# EasyEDA Pro project PCB.eprj, schematic Schematic1_1
Board Name: tc264_拓展_1; Create Date: 2025-07-30; Page Name: P1; Project Name: RG_PCB; Schematic Name: Schematic1_1; Update Date: 2025-07-30; Company: 嘉立创EDA; Page Size: A3; Version: V1.0
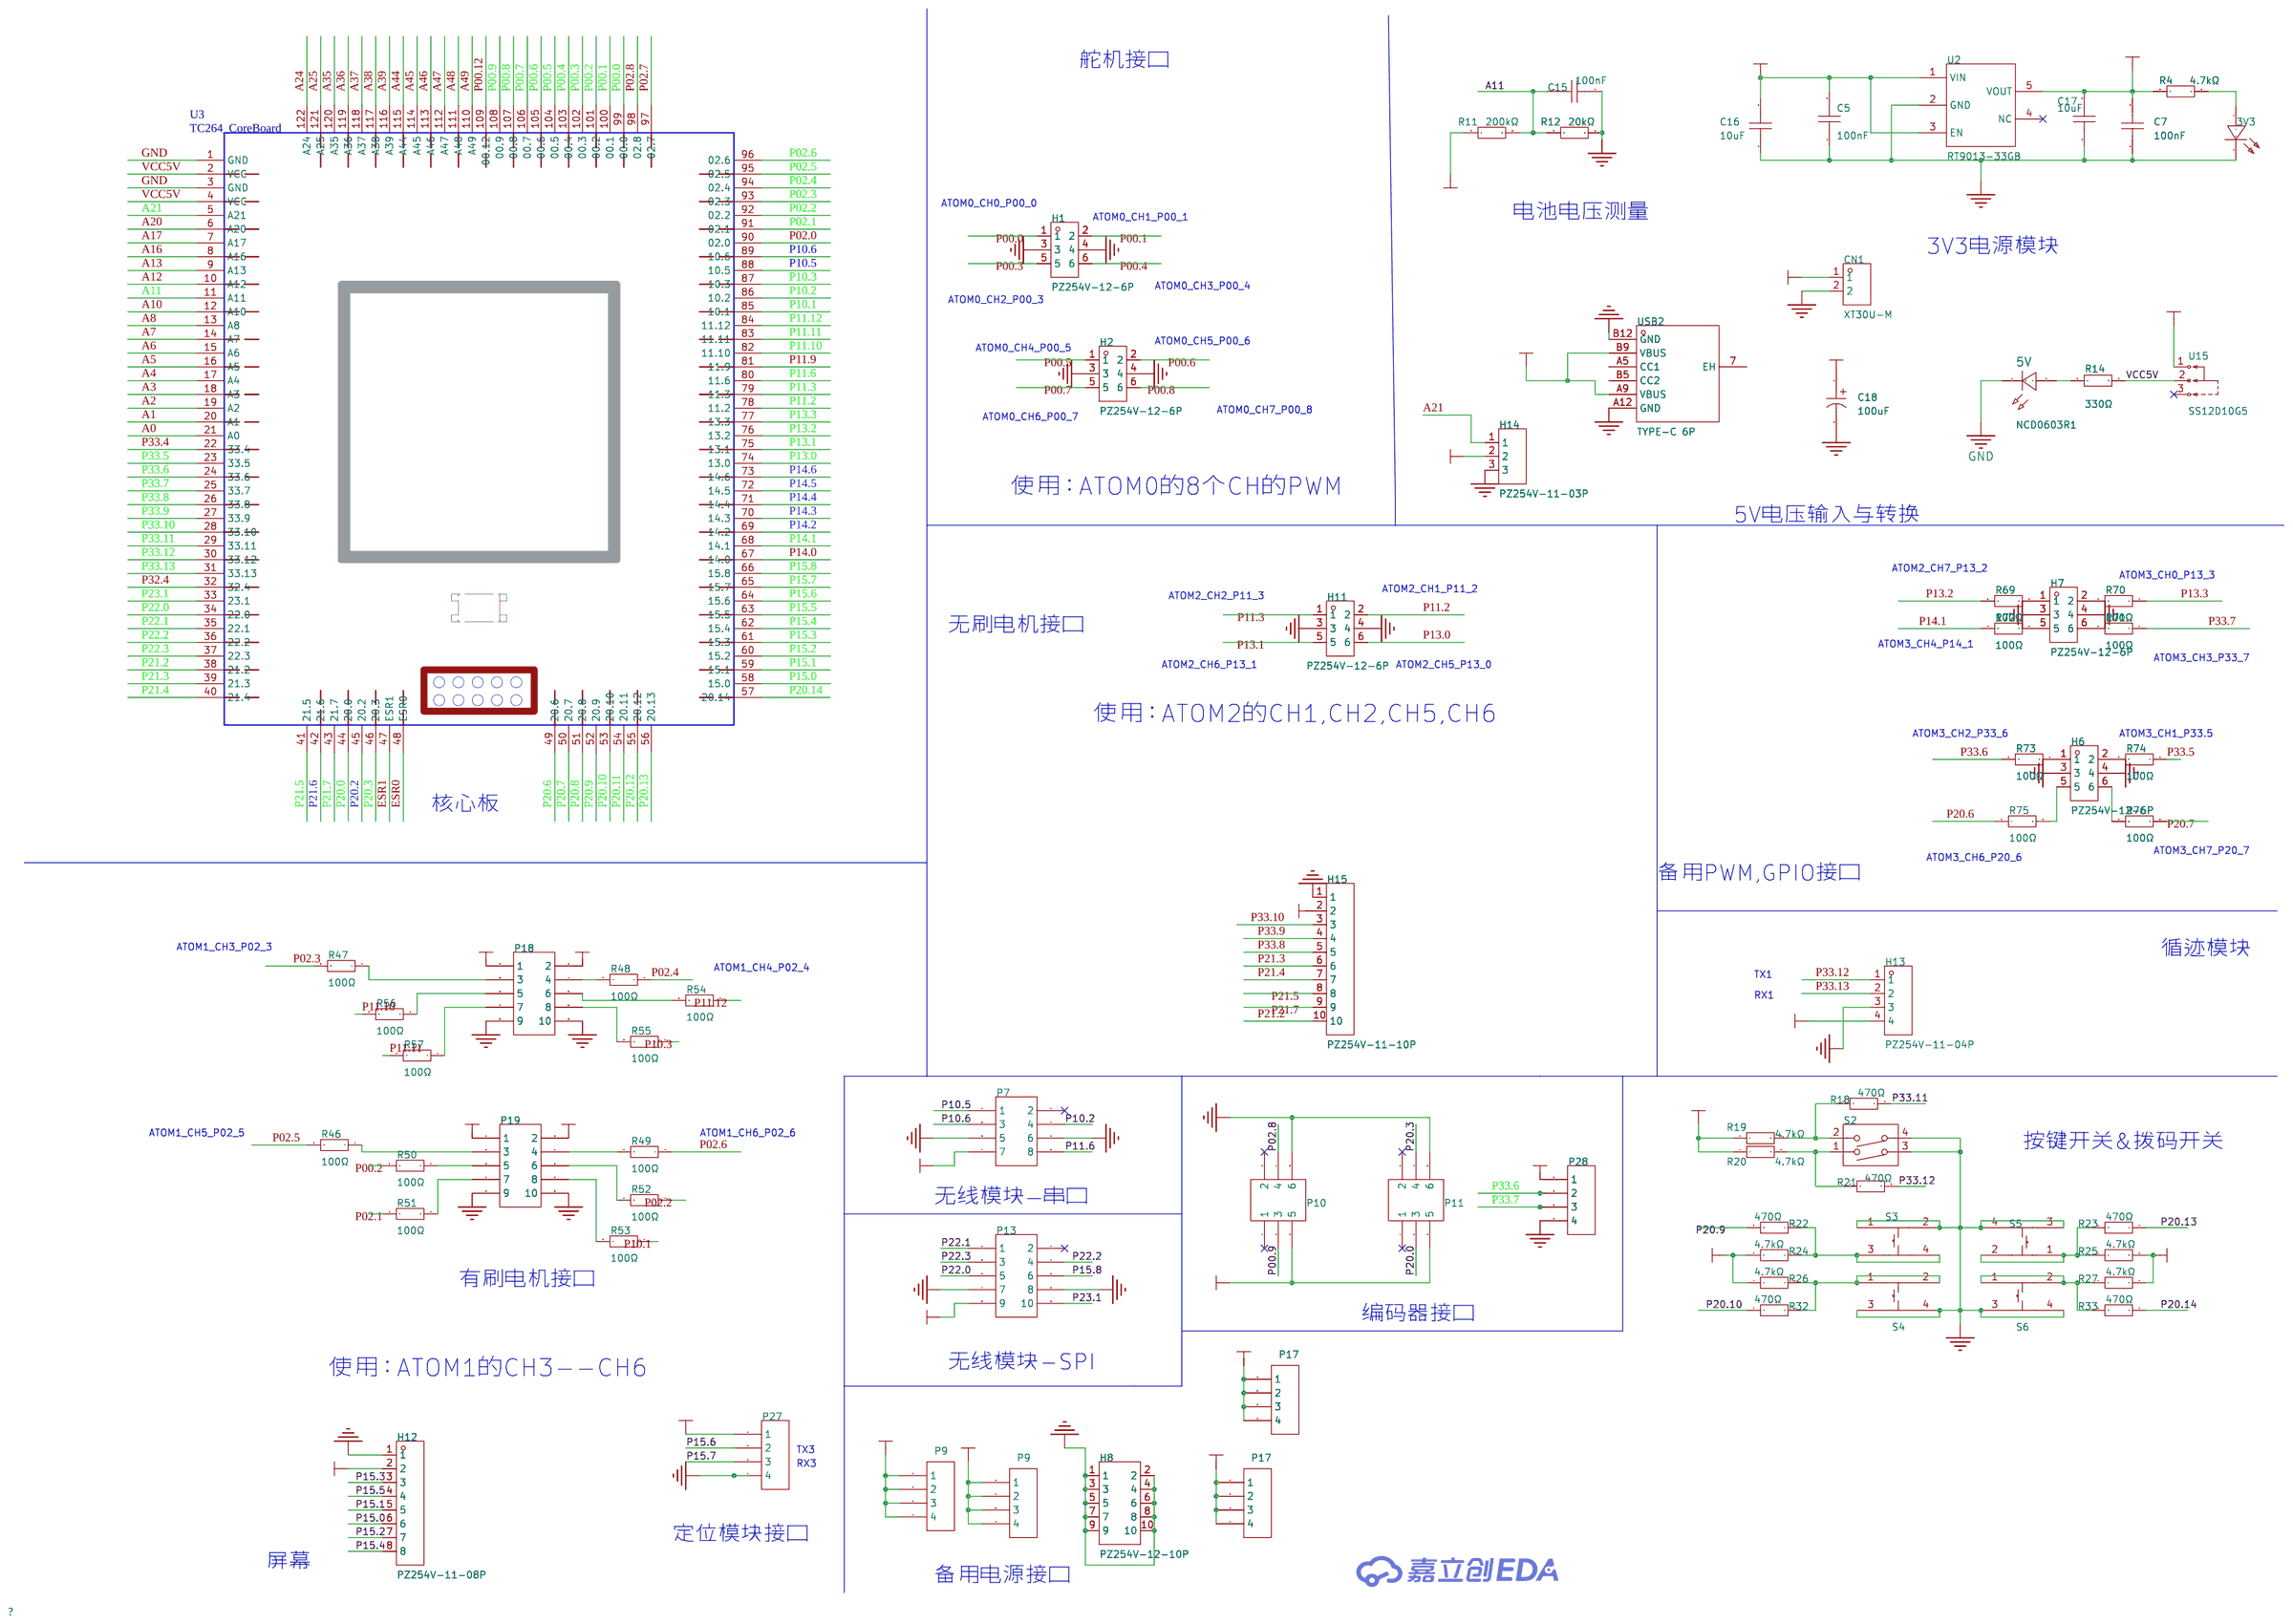
[diagram p1: schematic sheet]

## Parts
3V3  15-21VGC/TR8  [LED0603_GREEN]
5V  NCD0603R1  [LED0603-RD_RED]
C5  100nF  [C0603]
C7  100nF  [C0603]
C15  100nF  [C0603]
C16  10uF  [C1206]
C17  10uF  [C1206]
C18  100uF  [CAP-SMD_BD6.3-L6.6-W6.6-LS7.3-FD]
CN1  XT30U-M  [CONN-TH_XT30U-M]
H1  PZ254V-12-6P  [HDR-TH_6P-P2.54-V-M-R2-C3-S2.54]
H2  PZ254V-12-6P  [HDR-TH_6P-P2.54-V-M-R2-C3-S2.54]
H6  PZ254V-12-6P  [HDR-TH_6P-P2.54-V-M-R2-C3-S2.54]
H7  PZ254V-12-6P  [HDR-TH_6P-P2.54-V-M-R2-C3-S2.54]
H8  PZ254V-12-10P  [HDR-TH_10P-P2.54-V-M-R2-C5-S2.54]
H11  PZ254V-12-6P  [HDR-TH_6P-P2.54-V-M-R2-C3-S2.54]
H12  PZ254V-11-08P  [HDR-TH_8P-P2.54-V-M]
H13  PZ254V-11-04P  [HDR-TH_4P-P2.54-V-M]
H14  PZ254V-11-03P  [HDR-TH_3P-P2.54-V-M]
H15  PZ254V-11-10P  [HDR-TH_10P-P2.54-V-M]
P2  P9  [HDR1X4]
P6  P17  [HDR1X4]
P7  -  [HDR2X4]
P10  -  [HDR2X3]
P11  -  [HDR2X3]
P13  -  [HDR2X5]
P18  -  [HDR2X5]
P19  -  [HDR2X5]
P25  P9  [HDR1X4]
P26  P17  [HDR1X4]
P27  -  [HDR1X4]
P28  -  [HDR1X4]
R4  4.7kΩ  [R0603]
R11  200kΩ  [R0603]
R12  20kΩ  [R0603]
R14  330Ω  [R0603]
R18  470Ω  [R0603]
R19  4.7kΩ  [R0603]
R20  4.7kΩ  [R0603]
R21  470Ω  [R0603]
R22  470Ω  [R0603]
R23  470Ω  [R0603]
R24  4.7kΩ  [R0603]
R25  4.7kΩ  [R0603]
R26  4.7kΩ  [R0603]
R27  4.7kΩ  [R0603]
R32  470Ω  [R0603]
R33  470Ω  [R0603]
R46  100Ω  [R0603]
R47  100Ω  [R0603]
R48  100Ω  [R0603]
R49  100Ω  [R0603]
R50  100Ω  [R0603]
R51  100Ω  [R0603]
R52  100Ω  [R0603]
R53  100Ω  [R0603]
R54  100Ω  [R0603]
R55  100Ω  [R0603]
R56  100Ω  [R0603]
R57  100Ω  [R0603]
R69  100Ω  [R0603]
R70  100Ω  [R0603]
R71  100Ω  [R0603]
R72  100Ω  [R0603]
R73  100Ω  [R0603]
R74  100Ω  [R0603]
R75  100Ω  [R0603]
R76  100Ω  [R0603]
S2  拨码开关,平拨开关,DSWB02LHGET  [SW-TH_DSWB02LHGET]
S3  SKRPACE010  [KEY-SMD_4P-L4.2-W3.2-P2.20-LS4.6]
S4  SKRPACE010  [KEY-SMD_4P-L4.2-W3.2-P2.20-LS4.6]
S5  SKRPACE010  [KEY-SMD_4P-L4.2-W3.2-P2.20-LS4.6]
S6  SKRPACE010  [KEY-SMD_4P-L4.2-W3.2-P2.20-LS4.6]
U2  RT9013-33GB  [SOT-23-5_L3.0-W1.7-P0.95-LS2.8-BL]
U3  TC264_CoreBoard  [TC264_CoreBoard]
U15  SS12D10G5  [SW-TH_SHOU-HAN_SS12D10G4]
USB2  TYPE-C 6P  [TYPE-C-SMD_TYPE-C-6P]

## Library data of the parts
3V3 = 15-21VGC/TR8: 照明颜色:普绿/黄绿;色温 - CCT（K）:-;主波长/色坐标:571nm;; LCSC Part Name: 发光二极管1206普绿/黄绿; Supplier Part: C131289; Manufacturer: EVERLIGHT(亿光); Supplier Footprint: 1206; JLCPCB Part Class: Extended Part; Datasheet: https://atta.szlcsc.com/upload/public/pdf/source/20170918/C131289_1505726897595976297.pdf; Supplier: LCSC; Mounting Type: 表面贴装; Illumination Color: 普绿/黄绿; Luminous Intensity (IF=20mA): 13mcd; Dominant Wavelength / Coordinate rank: 571nm
5V = NCD0603R1_C84263: 灯头类型:-;发光颜色:红色;正向电压(VF):1.6V~2.6V;功率:65mW;正向电流:20mA;主波长:615nm~630nm;二极管配置:独立二极管;透镜颜色:无色透明透镜;色温:-;发光强度:80mcd~220mcd;发光角度:130°;载带方式:-;工作温度:-30℃~+85℃;; Supplier Part: C84263; Manufacturer: 国星光电; Supplier Footprint: 0603; JLCPCB Part Class: Extended Part; Datasheet: https://atta.szlcsc.com/upload/public/pdf/source/20200820/C84263_DABC6A75E58F576973B407FDBA283D60.pdf; Supplier: LCSC; Emitted Color: 红色; Forward Voltage (VF): 1.6V~2.6V; Power Dissipation: 65mW; Forward Current: 20mA; Dominant Wavelength: 615nm~630nm; Diode Configuration: 独立二极管; Lens Color: 无色透明透镜; Luminous Intensity: 80mcd~220mcd; Viewing Angle: 130°; Operating Temperature: -30℃~+85℃
C5 C7 = CL10B104KB8NNNC: 容值:100nF;精度:±10%;额定电压:50V;材质(温度系数):X7R;; LCSC Part Name: 100nF ±10% 50V; Supplier Part: C1591; Manufacturer: SAMSUNG(三星); Supplier Footprint: 0603; JLCPCB Part Class: Extended Part; Datasheet: https://atta.szlcsc.com/upload/public/pdf/source/20160103/1457707680512.pdf; Supplier: LCSC; Tolerance: ±10%; Voltage Rated: 50V; Temperature Coefficient: X7R
C15 = CL10B104KB8VPJC: 容值:100nF;精度:±10%;额定电压:50V;材质(温度系数):-;; LCSC Part Name: 100nF ±10% 50V; Supplier Part: C2803384; Manufacturer: SAMSUNG(三星); Supplier Footprint: 0603; JLCPCB Part Class: Extended Part; Datasheet: https://atta.szlcsc.com/upload/public/pdf/source/20210617/C346226_6C124442B8E004027ECF60B29F82E9A1.pdf; Supplier: LCSC; Tolerance: ±10%; Voltage Rated: 50V
C16 C17 = CGA1206X5R106K500NT: 容值:10uF;精度:±10%;额定电压:50V;温度系数:X5R;; LCSC Part Name: 10uF ±10% 50V; Supplier Part: C6119958; Manufacturer: HRE(芯声); Supplier Footprint: 1206; Supplier: LCSC; Tolerance: ±10%; Voltage Rating: 50V; Temperature Coefficient: X5R
C18 = MA25V100M6x6: 容值:100uF;精度:±20%;额定电压:25V;纹波电流:2.65A@100kHz;等效串联电阻(ESR):30mΩ@100kHz;类型:聚合物;; LCSC Part Name: 100uF ±20% 25V; Supplier Part: C46550465; Manufacturer: 捷而瑞; Supplier Footprint: SMD,D6.3xL6mm; JLCPCB Part Class: 扩展库; Datasheet: https://atta.szlcsc.com/upload/public/pdf/source/20250527/0775B60C79545A62B473432786128FCC.pdf; Supplier: LCSC; Tolerance: ±20%; Voltage Rating: 25V; Ripple Current: 2.65A@100kHz; Equivalent Series Resistance(ESR): 30mΩ@100kHz; Type: 聚合物; Diameter: 6.3mm; Height - Seated (Max): 6mm; Lifetime: 2000hrs@105℃; Operating Temperature: -55℃~+105℃
CN1 = XT30U-M: 类别:-;类型1:-;; LCSC Part Name: AMASS(艾迈斯)轻量版锂电池插头公头 XT30U-M; Supplier Part: C99101; Manufacturer: AMASS(艾迈斯); JLCPCB Part Class: 扩展库; Datasheet: https://atta.szlcsc.com/upload/public/pdf/source/20170606/1496716542582.pdf; Supplier: LCSC; Type: 插头; Colour: 黄色; InterfaceType: 公头
H1 H2 H6 H7 H11 = PZ254V-12-6P: 插针结构:2x3P;间距:2.54mm;行距:2.54mm;圆针/方针:方针;安装类型:直插;排数:双排;总PIN位数:6P;额定电流:-;额定电压:-;配合针长度:6mm;塑高:2.5mm;端接针长度:3mm;触头材质:黄铜;触头镀层:-;工作温度范围:-40℃~+105℃;颜色:黑色;; LCSC Part Name: 间距:2.54mm 2x3P 直插 方针; Supplier Part: C492420; Manufacturer: XFCN(兴飞); Supplier Footprint: 插件,P=2.54mm; JLCPCB Part Class: 扩展库; Datasheet: https://atta.szlcsc.com/upload/public/pdf/source/20200309/C492420_BAECB307B001054C09D200388220EAE6.pdf; Supplier: LCSC; Pin Structure: 2x3P; Pitch: 2.54mm; Row Spacing: 2.54mm; Circluar Pins/Square Pins: 方针; Mounting Type: 直插; Number of Rows: 双排; Number of Pins: 6P; Length of Mating Pin: 6mm; Insulation Height: 2.5mm; Length of End Connection Pin: 3mm; Contact Material: 黄铜; Operating Temperature Range: -40℃~+105℃; Color: 黑色
H8 = PZ254V-12-10P: 插针结构:2x5P;间距:2.54mm;行距:2.54mm;圆针/方针:方针;安装方式:直插;排数:双排;总PIN位数:10P;额定电流:-;额定电压:-;配合针长度:6mm;塑高:2.5mm;端接针长度:3mm;触头材质:黄铜;触头镀层:-;工作温度:-40℃~+105℃;颜色:黑色;; LCSC Part Name: 2x5P 间距:2.54mm 方针 直插; Supplier Part: C492422; Manufacturer: XFCN(兴飞); Supplier Footprint: 插件,P=2.54mm; JLCPCB Part Class: 扩展库; Datasheet: https://atta.szlcsc.com/upload/public/pdf/source/20200309/C492422_5020CEA01BE7051F9EA9DD81AB0A25E3.pdf; Supplier: LCSC; Pin Structure: 2x5P; Pitch: 2.54mm; Row Spacing: 2.54mm; Circluar Pins/Square Pins: 方针; Mounting Type: 直插; Number of Rows: 双排; Number of Pins: 10P; Length of Mating Pin: 6mm; Insulation Height: 2.5mm; Length of End Connection Pin: 3mm; Contact Material: 黄铜; Operating Temperature: -40℃~+105℃; Color: 黑色
H12 = PZ254V-11-08P: 插针结构:1x8P;间距:2.54mm;行距:-;圆针/方针:方针;安装类型:直插;排数:单排;总PIN位数:8P;额定电流:-;额定电压:-;配合针长度:6mm;塑高:2.5mm;端接针长度:3mm;触头材质:黄铜;触头镀层:-;工作温度范围:-40℃~+105℃;颜色:黑色;; LCSC Part Name: 间距:2.54mm 1x8P 直插 方针; Supplier Part: C492407; Manufacturer: XFCN(兴飞); Supplier Footprint: 插件,P=2.54mm; JLCPCB Part Class: 扩展库; Datasheet: https://atta.szlcsc.com/upload/public/pdf/source/20200309/C492407_83A6FB26A2233368EDB9516968EC6149.pdf; Supplier: LCSC; Pin Structure: 1x8P; Pitch: 2.54mm; Circluar Pins/Square Pins: 方针; Mounting Type: 直插; Number of Rows: 单排; Number of Pins: 8P; Length of Mating Pin: 6mm; Insulation Height: 2.5mm; Length of End Connection Pin: 3mm; Contact Material: 黄铜; Operating Temperature Range: -40℃~+105℃; Color: 黑色
H13 = PZ254V-11-04P: 插针结构:1x4P;间距:2.54mm;行距:-;圆针/方针:方针;安装类型:直插;排数:单排;总PIN位数:4P;额定电流:3A;额定电压:250V;配合针长度:6mm;塑高:2.5mm;端接针长度:3mm;触头材质:-;工作温度范围:-40℃~+105℃;颜色:黑色;; LCSC Part Name: 间距:2.54mm 1x4P 直插 方针; Supplier Part: C2691448; Manufacturer: XFCN(兴飞); Supplier Footprint: 插件,P=2.54mm; JLCPCB Part Class: 扩展库; Datasheet: https://atta.szlcsc.com/upload/public/pdf/source/20200309/C492403_F9F19131791D08044AD4F84F8E751A34.pdf; Supplier: LCSC; Pin Structure: 1x4P; Pitch: 2.54mm; Circluar Pins/Square Pins: 方针; Mounting Type: 直插; Number of Rows: 单排; Number of Pins: 4P; Current Rating (Max): 3A; Voltage Rating (Max): 250V; Length of Mating Pin: 6mm; Insulation Height: 2.5mm; Length of End Connection Pin: 3mm; Operating Temperature Range: -40℃~+105℃; Color: 黑色
H14 = PZ254V-11-03P: 插针结构:1x3P;间距:2.54mm;行距:-;圆针/方针:方针;安装方式:直插;排数:单排;总PIN位数:3P;额定电流:3A;额定电压:250V;配合针长度:6mm;塑高:2.5mm;端接针长度:3mm;工作温度:-40℃~+105℃;颜色:黑色;; LCSC Part Name: 1x3P 间距:2.54mm 方针 直插; Supplier Part: C2937625; Manufacturer: XFCN(兴飞); Supplier Footprint: 插件,P=2.54mm; JLCPCB Part Class: 扩展库; Datasheet: https://item.szlcsc.com/datasheet/PZ254V-11-03P/3293280.html; Supplier: LCSC; Pin Structure: 1x3P; Pitch: 2.54mm; Circluar Pins/Square Pins: 方针; Mounting Type: 直插; Number of Rows: 单排; Number of Pins: 3P; Current Rating: 3A; Voltage Rating (Max): 250V; Length of Mating Pin: 6mm; Insulation Height: 2.5mm; Length of End Connection Pin: 3mm; Operating Temperature: -40℃~+105℃; Color: 黑色
H15 = PZ254V-11-10P: 插针结构:1x10P;间距:2.54mm;行距:-;圆针/方针:方针;安装方式:直插;排数:单排;总PIN位数:10P;额定电流:-;额定电压:-;配合针长度:6mm;塑高:2.5mm;端接针长度:3mm;触头材质:黄铜;触头镀层:-;工作温度:-40℃~+105℃;颜色:黑色;; LCSC Part Name: 1x10P 间距:2.54mm 方针 直插; Supplier Part: C492409; Manufacturer: XFCN(兴飞); Supplier Footprint: 插件,P=2.54mm; JLCPCB Part Class: 扩展库; Datasheet: https://atta.szlcsc.com/upload/public/pdf/source/20200309/C492409_129C9431BDD62EBBBD0A643B6AAB9FBD.pdf; Supplier: LCSC; Pin Structure: 1x10P; Pitch: 2.54mm; Circluar Pins/Square Pins: 方针; Mounting Type: 直插; Number of Rows: 单排; Number of Pins: 10P; Length of Mating Pin: 6mm; Insulation Height: 2.5mm; Length of End Connection Pin: 3mm; Contact Material: 黄铜; Operating Temperature: -40℃~+105℃; Color: 黑色
P2 P6 P25-P28 = HDR-D-M 1*4p
P7 = HDR-D-F 2*4P
P10 P11 = HDR-D-M 2*3P
P13 P18 P19 = HDR-D-F 2*5P
R4 R11 R12 R18-R27 R32 R33 R46-R57 R69-R76 = RC0603FR-074K7L: 阻值:4.7kΩ;精度:±1%;功率:100mW;温度系数:±100ppm/℃;最大工作电压:75V;工作温度范围:-55℃~+155℃;; LCSC Part Name: 4.7kΩ ±1% 100mW; Supplier Part: C99782; Manufacturer: YAGEO(国巨); Supplier Footprint: 0603; JLCPCB Part Class: Extended Part; Datasheet: https://atta.szlcsc.com/upload/public/pdf/source/20171030/C99782_15093665213961068236.pdf; Supplier: LCSC; Tolerance: ±1%; Power(Watts): 100mW; Temperature Coefficient: ±100ppm/℃; Overload Voltage (Max): 75V; Operating Temperature Range: -55℃~+155℃
R14 = AC0603FR-07330RL: 电阻类型:厚膜电阻;阻值:330Ω;精度:±1%;功率:100mW;温度系数:±100ppm/℃;最大工作电压:75V;工作温度范围:-55℃~+155℃;; LCSC Part Name: 330Ω ±1%; Supplier Part: C144668; Manufacturer: YAGEO(国巨); Supplier Footprint: 0603; JLCPCB Part Class: Extended Part; Datasheet: https://atta.szlcsc.com/upload/public/pdf/source/20171225/C144668_15141880408521202956.pdf; Supplier: LCSC; Type: 厚膜电阻; Tolerance: ±1%; Power(Watts): 100mW; Temperature Coefficient: ±100ppm/℃; Overload Voltage (Max): 75V; Operating Temperature Range: -55℃~+155℃
S2 = 拨码开关,平拨开关,DSWB02LHGET: 类型:平拨，凸起式;电路结构:单刀单掷;开关位数:2;引脚间距:2.54mm;颜色:红色;; Supplier Part: C99421; Manufacturer: YE; Supplier Footprint: 插件; JLCPCB Part Class: Extended Part; Datasheet: https://atta.szlcsc.com/upload/public/pdf/source/20170330/1490854270511.pdf; Supplier: LCSC; Type: 平拨，凸起式; Circuit: 单刀单掷; Number of Positions: 2; Lead Pitch: 2.54mm; Color: 红色
S3-S6 = SKRPACE010: 触点电流:50mA;额定电压(DC):16V;电路结构:单刀单掷;安装方式:立贴;带灯:-;机械寿命:-;; LCSC Part Name: 4.2*3.2*2.5mm 立贴 轻触开关; Supplier Part: C139797; Manufacturer: ALPSALPINE(阿尔卑斯阿尔派); Supplier Footprint: SMD; JLCPCB Part Class: 扩展库; Datasheet: https://atta.szlcsc.com/upload/public/pdf/source/20171113/C139797_15105612676371115729.pdf; Supplier: LCSC; Contact Current: 50mA; Voltage Rating (DC): 16V; Circuit: 单刀单掷; Mounting Style: 立贴; Actuator Style: 椭圆形按钮; Switch Length: 4.2mm; Switch Width: 3.2mm; Switch Height: 2.5mm
U2 = RT9013-33GB: 输出类型:固定;最大输入电压:5.5V;输出电压:3.3V;最大输出电流:500mA;电源纹波抑制比(PSRR):50dB@(10kHz);输出极性:正极;; LCSC Part Name: 输入5.5V 输出3.3V 500mA; Supplier Part: C47773; Manufacturer: RICHTEK(立锜); Supplier Footprint: SOT-23-5; JLCPCB Part Class: Extended Part; Datasheet: https://atta.szlcsc.com/upload/public/pdf/source/20150504/1457707282459.pdf; Supplier: LCSC; Output Type: 固定; Operating Temperature: -40℃~+85℃; Maximum Input Voltage: 5.5V; Output Voltage: 3.3V; MAX Output Current: 500mA; Power Supply Rejection Ratio (PSRR): 50dB@(10kHz); Dropout Voltage: 400mV@(500mA); standby current: 50uA; Output Polarity: 正极; Number of Outputs: 1
U3 = TC264_CoreBoard: 逐飞科技TC264核心板
U15 = SS12D10G5: 电路结构:单刀双掷;安装方式:直插;额定电流(DC):2A;额定电压(DC):125V;机械寿命:3千次;; LCSC Part Name: 两档立式插件 3脚拨动开关 柄长5.0mm; Supplier Part: C7431054; Manufacturer: SHOU HAN(首韩); Supplier Footprint: 插件; JLCPCB Part Class: Extended Part; Datasheet: https://atta.szlcsc.com/upload/public/pdf/source/20231130/7A3DB6A149BF0A1DCFFE64FFC07FE434.pdf; Supplier: LCSC; Circuit: 单刀双掷; Switch Length: 12.7mm; Switch Width: 6.7mm; Mounting Style: 直插; Current Rating (DC): 2A; Voltage Rating (DC): 125V; Mechanical Life: 3千次; Operating Temperature: -25℃~+70℃
USB2 = TYPE-C 6P: 连接器类型:Type-C;标准:USB 3.1;公母:母;安装方式:卧贴;触点数量:6P;端口数量:1;额定电流 - 电源:5A;工作温度范围:-40℃~+85℃;; LCSC Part Name: Type-C 母 卧贴; Supplier Part: C456012; Manufacturer: SHOU HAN(首韩); Supplier Footprint: SMD; JLCPCB Part Class: 扩展库; Datasheet: https://atta.szlcsc.com/upload/public/pdf/source/20201203/C456012_B13F72044DF846EDBE9BDD0D1D3CD166.pdf; Supplier: LCSC; Connector Type: Type-C; Standard: USB 3.1; Gender: 母; Mounting Style: 卧贴; Number of Contacts: 6P; Number of Ports: 1; Current Rating - Power (Max): 5A; Operating Temperature Range: -40℃~+85℃; Rated Voltage (Max): 20V; Connect-Disconnect Life: 3千次; Core Colour: 黑色

## Nets
GND: 3V3.2(C) 5V.1(C) C5.1 C7.1 C15.1 C16.1 C17.1 C18.2 CN1.2 H1.3 H1.4 H2.3 H2.4 H6.3 H6.4 H7.3 H7.4 H8.1 H8.2 H8.3 H8.4 H8.5 H8.6 H8.7 H8.8 H8.9 H8.10 H11.3 H11.4 H12.1 H13.3 H14.3 H15.1 P7.5 P7.6 P10.6 P11.6 P13.7 P13.8 P18.9 P18.10 P19.9 P19.10 P27.4 P28.4 R12.2 S2.3 S2.4 S3.1 S3.2 S4.3 S4.4 S5.3 S5.4 S6.3 S6.4 U2.2(GND) U3.1(GND) U3.3(GND) USB2.A12(GND) USB2.B12(GND)
VCC3V3: C7.2 C17.2 H12.2 H14.2 P2.1 P2.2 P2.3 P2.4 P10.5 P11.5 P18.1 P18.2 P19.1 P19.2 P25.1 P25.2 P25.3 P25.4 R4.1 R19.1 R20.1 R24.1 R25.2 R26.1 R27.2 U2.5(VOUT)
VCC5V: C5.2 C16.2 C18.1 H13.4 H15.2 P6.1 P6.2 P6.3 P6.4 P7.7 P13.9 P26.1 P26.2 P26.3 P26.4 P27.1 P28.1 R11.1 R14.2 U2.1(VIN) U2.3(EN) U3.2(VCC) U3.4(VCC) U15.2
VCCIN: CN1.1 U15.1 USB2.A9(VBUS) USB2.B9(VBUS)
A0: U3.21(A0)
A1: U3.20(A1)
A2: U3.19(A2)
A3: U3.18(A3)
A4: U3.17(A4)
A5: U3.16(A5)
A6: U3.15(A6)
A7: U3.14(A7)
A8: U3.13(A8)
A10: U3.12(A10)
A11: C15.2 R11.2 R12.1 U3.11(A11)
A12: U3.10(A12)
A13: U3.9(A13)
A16: U3.8(A16)
A17: U3.7(A17)
A20: U3.6(A20)
A21: H14.1 U3.5(A21)
A24: U3.122(A24)
A25: U3.121(A25)
A35: U3.120(A35)
A36: U3.119(A36)
A37: U3.118(A37)
A38: U3.117(A38)
A39: U3.116(A39)
A44: U3.115(A44)
A45: U3.114(A45)
A46: U3.113(A46)
A47: U3.112(A47)
A48: U3.111(A48)
A49: U3.110(A49)
ESR0: U3.48(ESR0)
ESR1: U3.47(ESR1)
P00.0: H1.1 U3.99(00.0)
P00.1: H1.2 U3.100(00.1)
P00.2: R50.2 U3.101(00.2)
P00.3: H1.5 U3.102(00.3)
P00.4: H1.6 U3.103(00.4)
P00.5: H2.1 U3.104(00.5)
P00.6: H2.2 U3.105(00.6)
P00.7: H2.5 U3.106(00.7)
P00.8: H2.6 U3.107(00.8)
P00.9: P10.3 U3.108(00.9)
P00.12: U3.109(00.12)
P02.0: U3.90(02.0)
P02.1: R51.2 U3.91(02.1)
P02.2: R52.1 U3.92(02.2)
P02.3: R47.2 U3.93(02.3)
P02.4: R48.1 U3.94(02.4)
P02.5: R46.2 U3.95(02.5)
P02.6: R49.1 U3.96(02.6)
P02.7: U3.97(02.7)
P02.8: P10.4 U3.98(02.8)
P10.1: R53.1 U3.85(10.1)
P10.2: P7.4 U3.86(10.2)
P10.3: R55.1 U3.87(10.3)
P10.5: P7.1 U3.88(10.5)
P10.6: P7.3 U3.89(10.6)
P11.2: H11.2 U3.78(11.2)
P11.3: H11.1 U3.79(11.3)
P11.6: P7.8 U3.80(11.6)
P11.9: U3.81(11.9)
P11.10: R56.2 U3.82(11.10)
P11.11: R57.2 U3.83(11.11)
P11.12: R54.1 U3.84(11.12)
P13.0: H11.6 U3.74(13.0)
P13.1: H11.5 U3.75(13.1)
P13.2: R69.2 U3.76(13.2)
P13.3: R70.1 U3.77(13.3)
P14.0: U3.67(14.0)
P14.1: R72.2 U3.68(14.1)
P14.2: U3.69(14.2)
P14.3: U3.70(14.3)
P14.4: U3.71(14.4)
P14.5: U3.72(14.5)
P14.6: U3.73(14.6)
P15.0: H12.6 U3.58(15.0)
P15.1: H12.5 U3.59(15.1)
P15.2: H12.7 U3.60(15.2)
P15.3: H12.3 U3.61(15.3)
P15.4: H12.8 U3.62(15.4)
P15.5: H12.4 U3.63(15.5)
P15.6: P27.2 U3.64(15.6)
P15.7: P27.3 U3.65(15.7)
P15.8: P13.6 U3.66(15.8)
P20.0: P11.3 U3.44(20.0)
P20.2: U3.45(20.2)
P20.3: P11.4 U3.46(20.3)
P20.6: R75.1 U3.49(20.6)
P20.7: R76.1 U3.50(20.7)
P20.8: U3.51(20.8)
P20.9: R22.2 U3.52(20.9)
P20.10: R32.1 U3.53(20.10)
P20.11: U3.54(20.11)
P20.12: U3.55(20.12)
P20.13: R23.1 U3.56(20.13)
P20.14: R33.1 U3.57(20.14)
P21.2: H15.10 U3.38(21.2)
P21.3: H15.6 U3.39(21.3)
P21.4: H15.7 U3.40(21.4)
P21.5: H15.8 U3.41(21.5)
P21.6: U3.42(21.6)
P21.7: H15.9 U3.43(21.7)
P22.0: P13.5 U3.34(22.0)
P22.1: P13.1 U3.35(22.1)
P22.2: P13.4 U3.36(22.2)
P22.3: P13.3 U3.37(22.3)
P23.1: P13.10 U3.33(23.1)
P32.4: U3.32(32.4)
P33.4: U3.22(33.4)
P33.5: R74.1 U3.23(33.5)
P33.6: P28.2 R73.2 U3.24(33.6)
P33.7: P28.3 R71.1 U3.25(33.7)
P33.8: H15.5 U3.26(33.8)
P33.9: H15.4 U3.27(33.9)
P33.10: H15.3 U3.28(33.10)
P33.11: R18.2 U3.29(33.11)
P33.12: H13.1 R21.2 U3.30(33.12)
P33.13: H13.2 U3.31(33.13)
$1N6457: R22.1 R24.2 S3.3 S3.4
$1N6464: R20.2 R21.1 S2.1
$1N6521: R26.2 R32.2 S4.1 S4.2
$1N6523: R27.1 R33.2 S6.1 S6.2
$1N6526: R23.2 R25.1 S5.1 S5.2
$1N6540: R18.1 R19.2 S2.2
$1N7202: 3V3.1(A) R4.2
$1N9792: P19.3 R46.1
$1N9831: P18.3 R47.1
$1N9876: P18.4 R48.2
$1N9918: P19.4 R49.2
$1N17350: P19.5 R50.1
$1N17388: P19.7 R51.1
$1N17426: P19.6 R52.2
$1N17465: P19.8 R53.2
$1N17509: P18.6 R54.2
$1N17551: P18.8 R55.2
$1N17596: P18.5 R56.1
$1N17635: P18.7 R57.1
$1N18547: 5V.2(A) R14.1
$1N23155: H7.1 R69.1
$1N23193: H7.2 R70.2
$1N23231: H7.6 R71.2
$1N23269: H7.5 R72.1
$1N23307: H6.1 R73.1
$1N23345: H6.2 R74.2
$1N23388: H6.5 R75.2
$1N23427: H6.6 R76.2

Not connected (* = marked no-connect by the designer): P7 2*; P10 1* 2*; P11 1* 2*; P13 2*; U2 4(NC)*; U15 3*; USB2 7(EH) A5(CC1) B5(CC2)

## Notes on the sheet
- 舵机接口
- ATOM0_CH0_P00_0
- ATOM0_CH1_P00_1
- 电池电压测量
- 3V3电源模块
- ATOM0_CH3_P00_4
- ATOM0_CH2_P00_3
- ATOM0_CH4_P00_5
- ATOM0_CH5_P00_6
- ATOM0_CH6_P00_7
- ATOM0_CH7_P00_8
- 使用：ATOM0的8个CH的PWM
- 5V电压输入与转换
- ATOM2_CH7_P13_2
- ATOM3_CH0_P13_3
- ATOM2_CH2_P11_3
- ATOM2_CH1_P11_2
- 无刷电机接口
- ATOM3_CH4_P14_1
- ATOM3_CH3_P33_7
- ATOM2_CH6_P13_1
- ATOM2_CH5_P13_0
- 使用：ATOM2的CH1,CH2,CH5,CH6
- ATOM3_CH2_P33_6
- ATOM3_CH1_P33.5
- 核心板
- ATOM3_CH6_P20_6
- ATOM3_CH7_P20_7
- 备用PWM,GPIO接口
- ATOM1_CH3_P02_3
- 循迹模块
- ATOM1_CH4_P02_4
- TX1
- RX1
- ATOM1_CH5_P02_5
- ATOM1_CH6_P02_6
- 按键开关&拨码开关
- 无线模块—串口
- 有刷电机接口
- 编码器接口
- 使用：ATOM1的CH3--CH6
- 无线模块-SPI
- TX3
- RX3
- 定位模块接口
- 屏幕
- 备用电源接口
